# EAGLE design SensorModule (EAGLE 7.6.0)
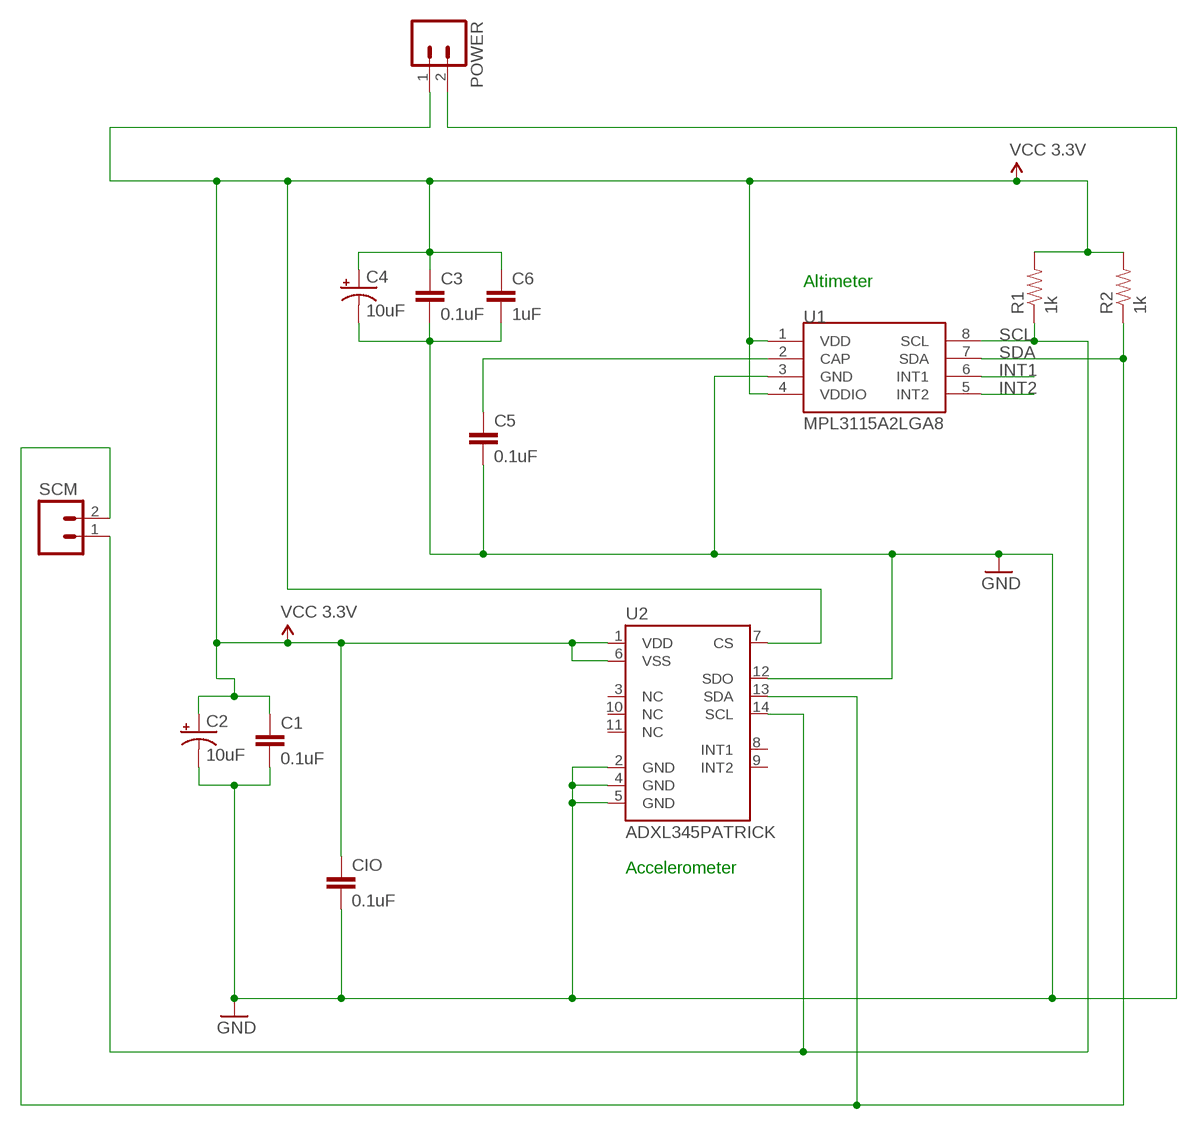
[diagram p0: schematic, sheet 1]

## Parts
C1  0.1uF  CAPPTH  [CAP-PTH-SMALL]
C2  10uF  CAP_POLPTH2  [CPOL-RADIAL-10UF-25V]
C3  0.1uF  CAPPTH  [CAP-PTH-SMALL]
C4  10uF  CAP_POLPTH2  [CPOL-RADIAL-10UF-25V]
C5  0.1uF  CAPPTH  [CAP-PTH-SMALL]
C6  1uF  CAPPTH  [CAP-PTH-SMALL]
CIO  0.1uF  CAPPTH  [CAP-PTH-SMALL]
POWER  M02PTH  [1X02]
R1  1k  RESISTORPTH-1/4W  [AXIAL-0.4]
R2  1k  RESISTORPTH-1/4W  [AXIAL-0.4]
SCM  M02PTH  [1X02]
U1  MPL3115A2LGA8  [LGA8]
U2  ADXL345PATRICK  [LGA14_1:1_PATRICK]

## Nets
GND: C1.2 C2.2(-) C3.2 C4.2(-) C5.2 C6.2 CIO.2 POWER.2 U1.3(GND) U2.2(GND) U2.4(GND) U2.5(GND) U2.12(SDO)
INT1: U1.6(INT1)
INT2: U1.5(INT2)
N$1: C5.1 U1.2(CAP)
SCL: R1.P$1 SCM.1 U1.8(SCL) U2.14(SCL)
SDA: R2.P$1 SCM.2 U1.7(SDA) U2.13(SDA)
VCC_3.3V: C1.1 C2.1(+) C3.1 C4.1(+) C6.1 CIO.1 POWER.1 R1.P$2 R2.P$2 U1.1(VDD) U1.4(VDDIO) U2.1(VDD) U2.6(VSS) U2.7(CS) ; supply symbol labelled VCC 3.3V
Unconnected: U2.3(NC) U2.8(INT1) U2.9(INT2) U2.10(NC) U2.11(NC)

## Notes on the sheet
- Altimeter
- Accelerometer

## Library data of the parts
C1 C3 C5 C6 CIO = SparkFun-Passives:CAP: Capacitor Standard 0603 ceramic capacitor, and 0.1" leaded capacitor.
C2 C4 = SparkFun-Passives:CAP_POL: Capacitor Polarized These are standard SMD and PTH capacitors. Normally 10uF, 47uF, and 100uF in electrolytic and tantalum varieties. Always verify the external diameter of the through hole cap, it varies with capacity, voltage, and manufacturer. The EIA devices should be standard.
POWER SCM = SparkFun-Connectors:M02: Standard 2-pin 0.1" header. Use with - straight break away headers ( PRT-00116) - right angle break away headers (PRT-00553) - swiss pins (PRT-00743) - machine pins (PRT-00117) - female headers (PRT-00115) Molex polarized connector foot print use with: PRT-08233 with associated crimp pins and housings. 2.54_SCREWTERM for use with PRT-10571. 3.5mm Screw Terminal footprints for PRT-08084 5mm Screw Terminal footprints for use with PRT-08432
R1 R2 = SparkFun-Passives:RESISTOR: Resistor Basic schematic elements and footprints for 0603, 1206, and PTH resistors.
U1 = SparkFun-Sensors:MPL3115A2: Altimeter/Pressure Sensor, I2C, 1.95V-3.6V supply, 50 to 110kPa
U2 = Testing:ADXL345

## Board
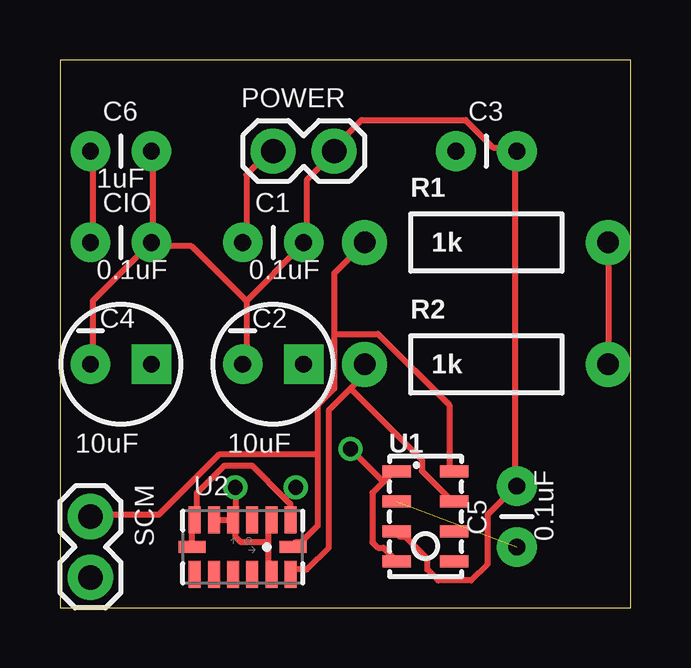
[diagram p1: board, top side]
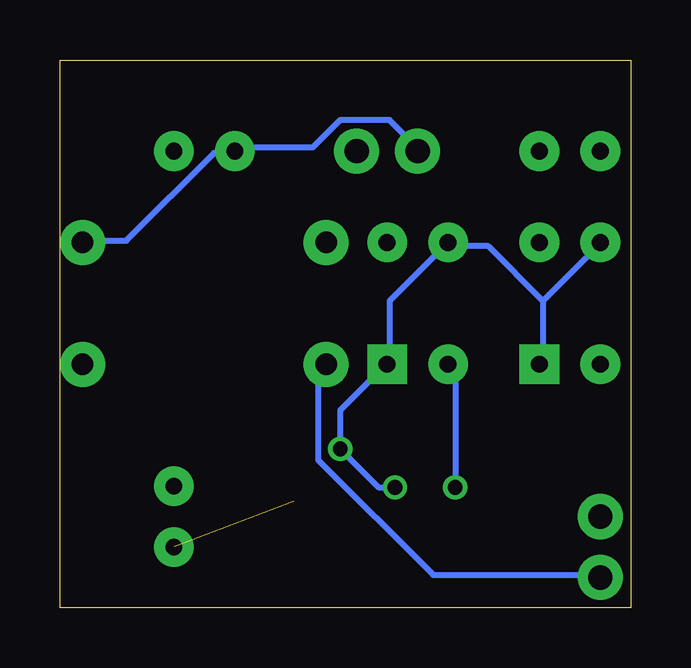
[diagram p2: board, bottom side, seen from below]

Size 23.8 x 22.85 mm. Coordinates in mm from the lower left corner, seen from the top.
Outline: 0,0 23.8,0 23.8,22.85 0,22.85 0,0
Copper layers (1*16): Top 0.035mm / dielectric 1.5mm / Bottom 0.035mm
Design rules "default": minimum track width 10mil, minimum drill 24mil, track to track 8mil, track to pad 8mil, pad to pad 8mil, via to via 8mil, smd to smd 8mil, copper to edge 40mil, drill to drill 8mil, minimum pad ring 10mil, minimum via ring 8mil, stop-mask expansion 4mil, vias tented up to drill 0mil, thermal gap 10mil

### Footprints (pad centres in the part's own frame; a part is rotated, then mirrored left to right if it is on the bottom)
CAP-PTH-SMALL = drill 0.7 pad 1.651: 1 0,0; 2 2.54,0
CPOL-RADIAL-10UF-25V = drill 0.7 pad 1.651 square: 1 1.27,0 | drill 0.7 pad 1.651: 2 -1.27,0
1X02 = drill 1.016 pad 1.88: 1 0,0; 2 2.54,0
AXIAL-0.4 = drill 0.9 pad 1.88: P$1 -5.08,0; P$2 5.08,0
LGA8 = smd 1.2 x 0.5: 1 -1.2,1.875; 2 -1.2,0.625; 3 -1.2,-0.625; 4 -1.2,-1.875; 5 1.2,-1.875; 6 1.2,-0.625; 7 1.2,0.625; 8 1.2,1.875
LGA14_1:1_PATRICK = smd 0.5 x 1.124: 1 2,1.138; 2 1.2,1.138; 3 0.4,1.138; 4 -0.4,1.138; 5 -1.2,1.138; 6 -2,1.138; 8 -2,-1.13; 9 -1.2,-1.138; 10 -0.4,-1.138; 11 0.4,-1.138; 12 1.2,-1.138; 13 2,-1.138 | smd 1.124 x 0.5: 7 -2.1,0; 14 2.1,0

### Placement (x,y rotation side)
C1  7.62,15.24 0 top
C2  8.89,10.16 0 top
C3  16.51,19.05 0 top
C4  2.54,10.16 0 top
C5  19.05,2.54 90 top
C6  1.27,19.05 0 top
CIO  1.27,15.24 0 top
POWER  8.89,19.05 0 top
R1  17.78,15.24 0 top
R2  17.78,10.16 0 top
SCM  1.27,3.81 270 top
U1  15.24,3.81 0 top
U2  7.62,2.54 0 top

### Tracks (layer width: path | path; a pad name or v marks a point on that pad's centre or on a via)
GND  (via drill 0.61)
  Top 0.254: CIO.2 1.37,12.8 1.37,10.29 C4.2 | C6.2 3.89,18.97 3.89,15.32 CIO.2 | U2.5 6.63,3.66 7.09,3.66 U2.4 | 8.69,2.74 8.69,3.66 U2.2 | 8.69,2.74 8.69,1.6 U2.12 | 8.69,2.74 7.54,2.74 7.32,2.97 7.32,3.66 U2.4 | v7.32,5.03 7.32,3.89 U2.4 | U1.3 14.17,2.97 14.4,2.97 15.32,2.06 15.32,1.6 15.77,1.14 17.14,1.14 17.83,1.83 17.83,3.89 18.97,5.03 C5.2 18.97,5.26 18.97,18.97 C3.2 18.97,19.2 18.06,19.2 16.92,20.34 12.57,20.34 11.43,19.2 POWER.2 11.43,18.97 10.29,17.83 10.29,15.32 C1.2 10.06,15.09 7.77,12.8 | 7.77,12.8 7.77,10.29 C2.2 | 7.77,12.8 5.49,15.09 3.89,15.09 CIO.2
  Bottom 0.254: v7.32,5.03 7.32,9.83 7.54,10.06 C2.2
N$1  (1 unrouted)
SCL
  Top 0.254: 10.74,6.4 10.74,8.46 11.43,9.14 11.43,11.43 | 10.74,6.4 10.74,3.43 10.06,2.74 9.83,2.74 U2.14 | 11.43,11.43 11.43,13.95 12.57,15.09 R1.P$1 | 11.43,11.43 13.26,11.43 16.23,8.46 16.23,5.71 U1.8 | 10.74,6.4 6.63,6.4 4.12,3.89 1.37,3.89 SCM.1
SDA
  Top 0.254: 12.12,9.14 12.57,9.6 12.57,10.06 R2.P$1 | 12.12,9.14 11.2,8.23 11.2,2.52 10.29,1.6 9.83,1.6 U2.13 | 12.12,9.14 15.09,6.17 15.09,5.71 16.23,4.57 U1.7
  Bottom 0.254: R2.P$1 13.03,9.83 13.03,6.17 8.23,1.37 1.37,1.37 SCM.2
VCC_3.3V  (via drill 0.61)
  Top 0.254: R1.P$2 R2.P$2 | U2.7 5.49,2.74 5.49,3.66 U2.6 5.71,3.89 5.71,4.8 6.86,5.94 8,5.94 9.37,4.57 | 9.37,4.57 9.6,4.34 9.6,3.89 U2.1 | 13.49,5.26 13.95,5.71 U1.1 | 13.49,5.26 13.03,4.8 13.03,2.74 13.26,2.52 13.49,2.52 13.95,2.06 U1.4 | v12.12,6.63 13.49,5.26 | v9.83,5.03 9.37,4.57 | C1.1 7.77,15.32 7.77,18.06 8.69,18.97 POWER.1 | CIO.1 1.37,15.32 1.37,18.97 C6.1
  Bottom 0.254: R1.P$2 22.86,15.32 21.03,15.32 17.37,18.97 16.69,18.97 C3.1 16.46,19.2 13.26,19.2 12.12,20.34 10.06,20.34 8.91,19.2 POWER.1 | v9.83,5.03 10.52,5.03 v12.12,6.63 12.12,8.23 10.29,10.06 C2.1 10.06,10.29 10.06,12.8 C1.1 7.54,15.09 5.94,15.09 3.66,12.8 | 3.66,12.8 3.66,10.29 C4.1 | 3.66,12.8 1.37,15.09 CIO.1